# Altium schematic sheet blockd2-rev1-env.SchDoc: Block Diagram
size A4; Date: 02/24/22; Author: Edward Kneller; SheetNumber: 2; SheetTotal: 4
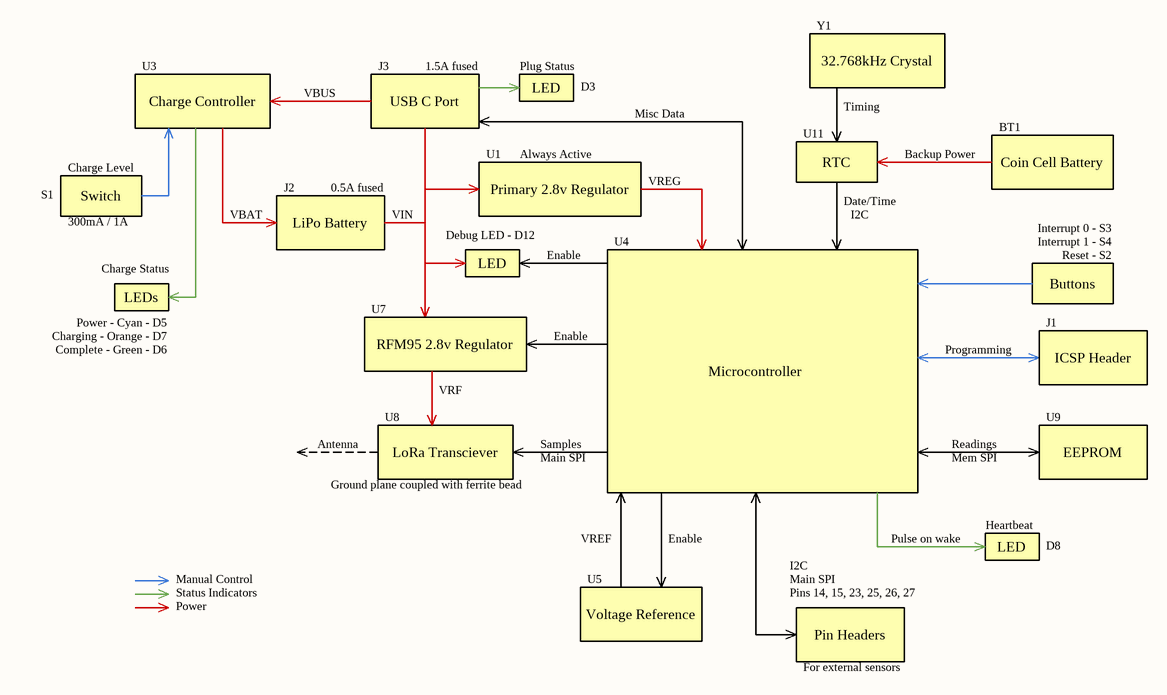
[diagram p0: blockd2-rev1-env.SchDoc]

## Notes on the sheet
- U3
- J3
- 1.5A fused
- Plug Status
- LED
- Y1
- 32.768kHz Crystal
- Charge Controller
- VBUS
- USB C Port
- D3
- Misc Data
- U11
- Timing
- BT1
- S1
- Charge Level
- Switch
- VBAT
- J2
- LiPo Battery
- 0.5A fused
- VIN
- U1
- Always Active
- Primary 2.8v Regulator
- VREG
- RTC
- Date/Time
- I2C
- Backup Power
- Coin Cell Battery
- 300mA / 1A
- Charge Status
- Debug LED - D12
- Enable
- U4
- Buttons
- Interrupt 0 - S3
- Interrupt 1 - S4
- Reset - S2
- LEDs
- Power - Cyan - D5
- Charging - Orange - D7
- Complete - Green - D6
- U7
- RFM95 2.8v Regulator
- Programming
- J1
- ICSP Header
- VRF
- Microcontroller
- Antenna
- Ground plane coupled with ferrite bead
- U8
- LoRa Transciever
- Samples
- Main SPI
- Readings
- Mem SPI
- U9
- EEPROM
- VREF
- Pulse on wake
- Heartbeat
- D8
- Manual Control
- Status Indicators
- Power
- U5
- Voltage Reference
- Pins 14, 15, 23, 25, 26, 27
- For external sensors
- Pin Headers